# Altium schematic sheet power.SchDoc
size A; SheetNumber: 3; SheetTotal: 8
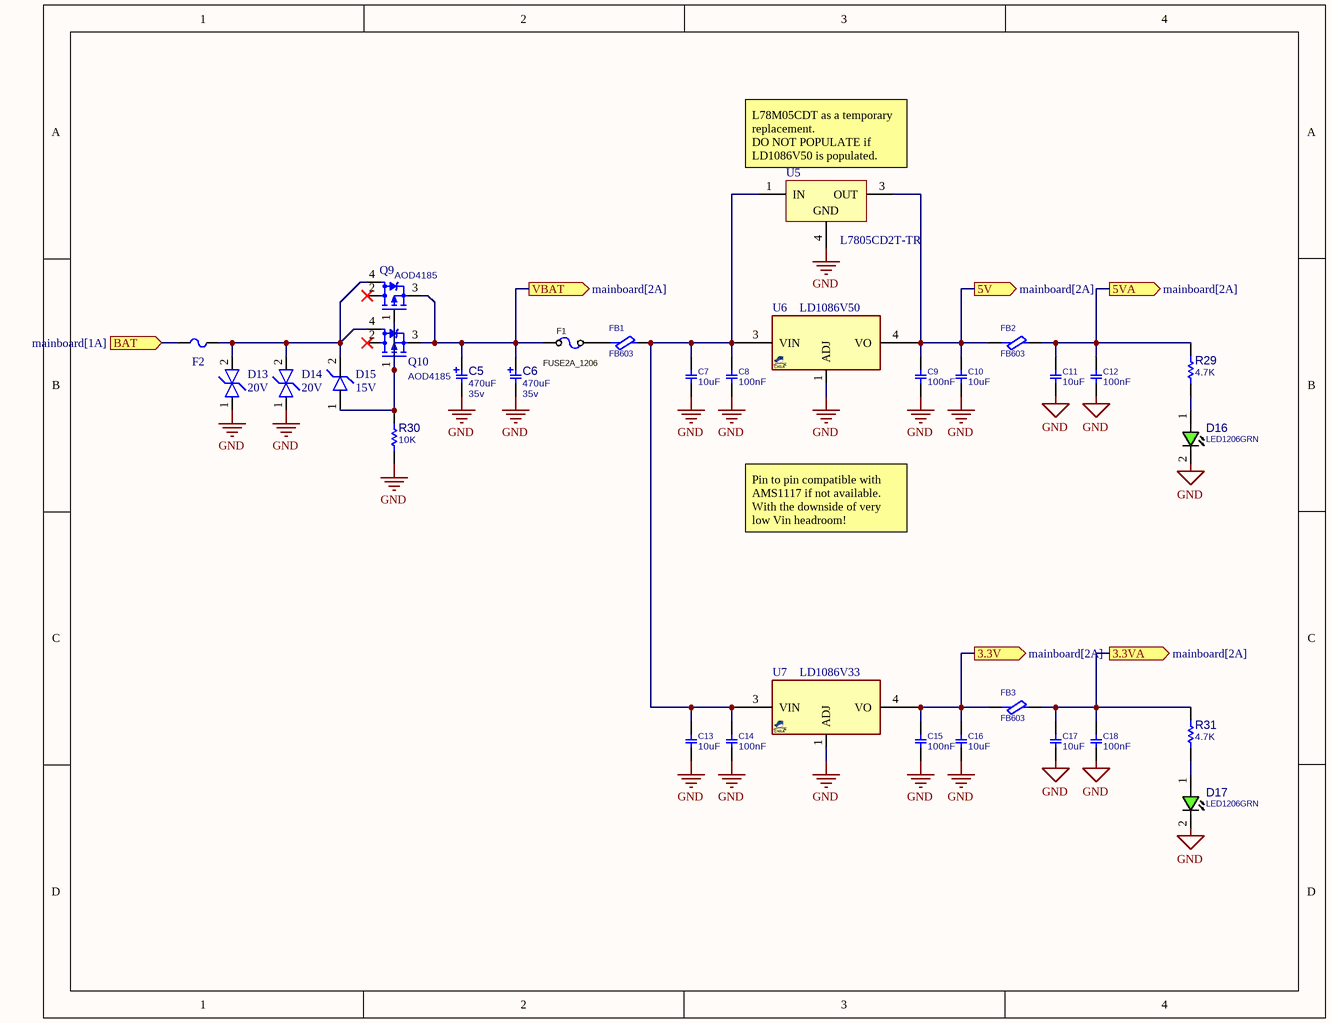
[diagram p0: power.SchDoc]

## Parts
C5  PARAM2: 35v  [C_EL_D10L10]  (hidden comment: 470uF)
C6  PARAM2: 35v  [C_EL_D10L10]  (hidden comment: 470uF)
C7  10uF  [C1206]
C8  100nF  [C1206]
C9  100nF  [C1206]
C10  10uF  [C1206]
C11  10uF  [C1206]
C12  100nF  [C1206]
C13  10uF  [C1206]
C14  100nF  [C1206]
C15  100nF  [C1206]
C16  10uF  [C1206]
C17  10uF  [C1206]
C18  100nF  [C1206]
D13  20V  [FP-SMBJ-CA-MFG]
D14  20V  [FP-SMBJ-CA-MFG]
D15  15V  [D_SOD80]
D16  LED1206GRN  [LED1206GRN]
D17  LED1206GRN  [LED1206GRN]
F1  FUSE2A_1206  [F1206]
F2  F=15 A  [FUSE - Double PAD]  (value not drawn)
FB1  FB603  [L1206]
FB2  FB603  [L1206]
FB3  FB603  [L1206]
Q9  AOD4185  [D2PAK_3]
Q10  AOD4185  [D2PAK_3]
R29  4.7K  [R0805]
R30  10K  [R0805]
R31  4.7K  [R0805]
U5  L7805CD2T-TR  [TO-263_M]
U6  LD1086V50  [DPAK_3]
U7  LD1086V33  [DPAK_3]

## Ports
3.3V (out, see mainboard[2A]), 3.3VA (out, see mainboard[2A]), 5V (out, see mainboard[2A]), 5VA (out, see mainboard[2A]), BAT (in, see mainboard[1A]), VBAT (out, see mainboard[2A])

## Nets
GND: C5.2 C6.2 C7.1 C8.1 C9.1 C10.1 C11.1 C12.1 C13.1 C14.1 C15.1 C16.1 C17.1 C18.1 D13.1 D14.1 D16.2(CATHODE) D17.2(CATHODE) R30.1 U5.4(GND) U6.1(ADJ) U7.1(ADJ)
3.3V: C15.2 C16.2 FB3.2 U7.4(VO) ; port 3.3V
3.3VA: C17.2 C18.2 FB3.1 R31.2 ; port 3.3VA
5V: C9.2 C10.2 FB2.2 U5.3(OUT) U6.4(VO) ; port 5V
5VA: C11.2 C12.2 FB2.1 R29.2 ; port 5VA
BAT: F2.1 ; port BAT
VBAT: C5.1 C6.1 F1.1 Q9.3(S) Q10.3(S) ; port VBAT
NetC7_2: C7.2 C8.2 C13.2 C14.2 FB1.1 U5.1(IN) U6.3(VIN) U7.3(VIN)
NetD13_2: D13.2 D14.2 D15.2 F2.2 Q9.4(D) Q10.4(D)
NetD15_1: D15.1 Q9.1(G) Q10.1(G) R30.2
NetD16_1: D16.1(ANODE) R29.1
NetD17_1: D17.1(ANODE) R31.1
NetF1_2: F1.2 FB1.2

Not connected (* = marked no-connect by the designer): Q9 2(D)*; Q10 2(D)*

## Notes on the sheet
- (near U5) L78M05CDT as a temporary replacement.
  DO NOT POPULATE if LD1086V50 is populated.
- Pin to pin compatible with AMS1117 if not available.
  With the downside of very low Vin headroom!

## Library data of the parts
C5 C6 = CAP_SMD_EL_470uF_35v: CAP, SMD, ELEC,; MANF_P#: MANF_PART#; DESC: DESCRIPTION; DIST#: MOUSER; PARAM: 20%; PRICE: 10= -$; MANF: MANF; ASSEMBLY: ASSEMBLY; VALUE: 470uF
C7 C10 C11 C13 C16 C17 = CAP_SMD_MLCC: CAP, MLCC; PARAM: C0G, 10%; DESC: CAP, MLCC, 1nF, 50V, C0G, 10%, 0402; MANF_P#: MANF_PART#; MANF: Murata; PARAM2: 50V; PRICE: 100= 1$; ASSEMBLY: ASSEMBLY; VALUE: 10uF
C8 C9 C12 C14 C15 C18 = CAP_SMD_MLCC_1206: CAP, MLCC; PARAM: -, -%; MANF_P#: MANF_PART#; PARAM2: -V; PRICE: 100= 1$; MANF: -; ASSEMBLY: ASSEMBLY; VALUE: 100nF
D13 D14 = TVS: TVS DIODE; Direction: Bidirectional; Reverse Standoff Voltage: 20V; ComponentLink2Description: Datasheet; ComponentLink2URL: https://www.bourns.com/docs/Product-Datasheets/SMBJ.pdf
D15 = Zener-SOD-80
D16 D17 = LED_SMD_1206_GRN: LED, SMD, 1206, GREEN; PARAM: 20mA; DESC: DESCRIPTION; PARAM2: 2.2V; MANF: -; ASSEMBLY: ASSEMBLY; PRICE: 36t@Javan; MANF_P#: -; VALUE: LED1206GRN
F1 = FUSE_3A_1206_SLOW: Fuse, 3A, 32VDC, 1206, SMD, Slow Blow; PARAM: 3A; 32VDC; Slow Blow; MANF: Bourns; MANF_P#: SF-1206SP300-2; PARAM2: 0.027Ohm; PRICE: 0.9$; VALUE: FUSE2A_1206
F2 = Fuse 5x20 with holdeer pins: Fuses 5x20; Designer: Abbas Basereh; Desc.: fuse with holder pins 5x20; Data: 28-12-2016
FB1-FB3 = FBEAD_SMD: FERRITE_Bead, SMD; MANF: MURATA; PARAM: 120@100MHz; PARAM2: 1A; MANF_P#: BLM15AG121SN1D; VALUE: FB603
Q9 Q10 = MOSP_IRF4905_D2PAK: HEXFET Power MOSFET; ASSEMBLY: ASSEMBLY; MANF_P#: IRF4905; VALUE: AOD4185
R29-R31 = RES_SMD_0805: RESISTOR, SMD; PARAM: -W; DESC: DESCRIPTION; DIST#: MOUSER; PARAM2: 1%; MANF_P#: -; MANF: -; ASSEMBLY: ASSEMBLY; PRICE: 100= 0.5$
  R29 R31: VALUE: 4.7K
  R30: VALUE: 10K
U5 = CMP-0244-00213-1: Positive Voltage Regulator, 3-Pin D2PAK, Tape and Reel; PackageReference: TO-263; ComponentLink2URL: http://www.st.com/internet/com/TECHNICAL_RESOURCES/TECHNICAL_LITERATURE/DATASHEET/CD00000444.pdf; PackageDescription: 3-Pin Transistor Outline Package 2.54 mm Pitch, 15.4 mm Lead Span (D2PAK); DatasheetVersion: 16/11/2011; ComponentLink2Description: Datasheet; ComponentLink1Description: Manufacturer URL; PackageVersion: 2011; ComponentLink1URL: http://www.st.com
U6 U7 = VREG_1086_TO252: REG, Linear, LDO1.3, Adj, 1A, TO-252; MANF_P#: LD1086DTTR, LD1086D2MTR; MANF: ST; PARAM2: 2.8~30VIN, 1.3VDROP, 1.25VREF; PARAM: 1A
  U6: VALUE: LD1086V50
  U7: VALUE: LD1086V33